# EAGLE design DDC118_eval2_rev1D (EAGLE 6.3)
Assembly variants: low-on-parts
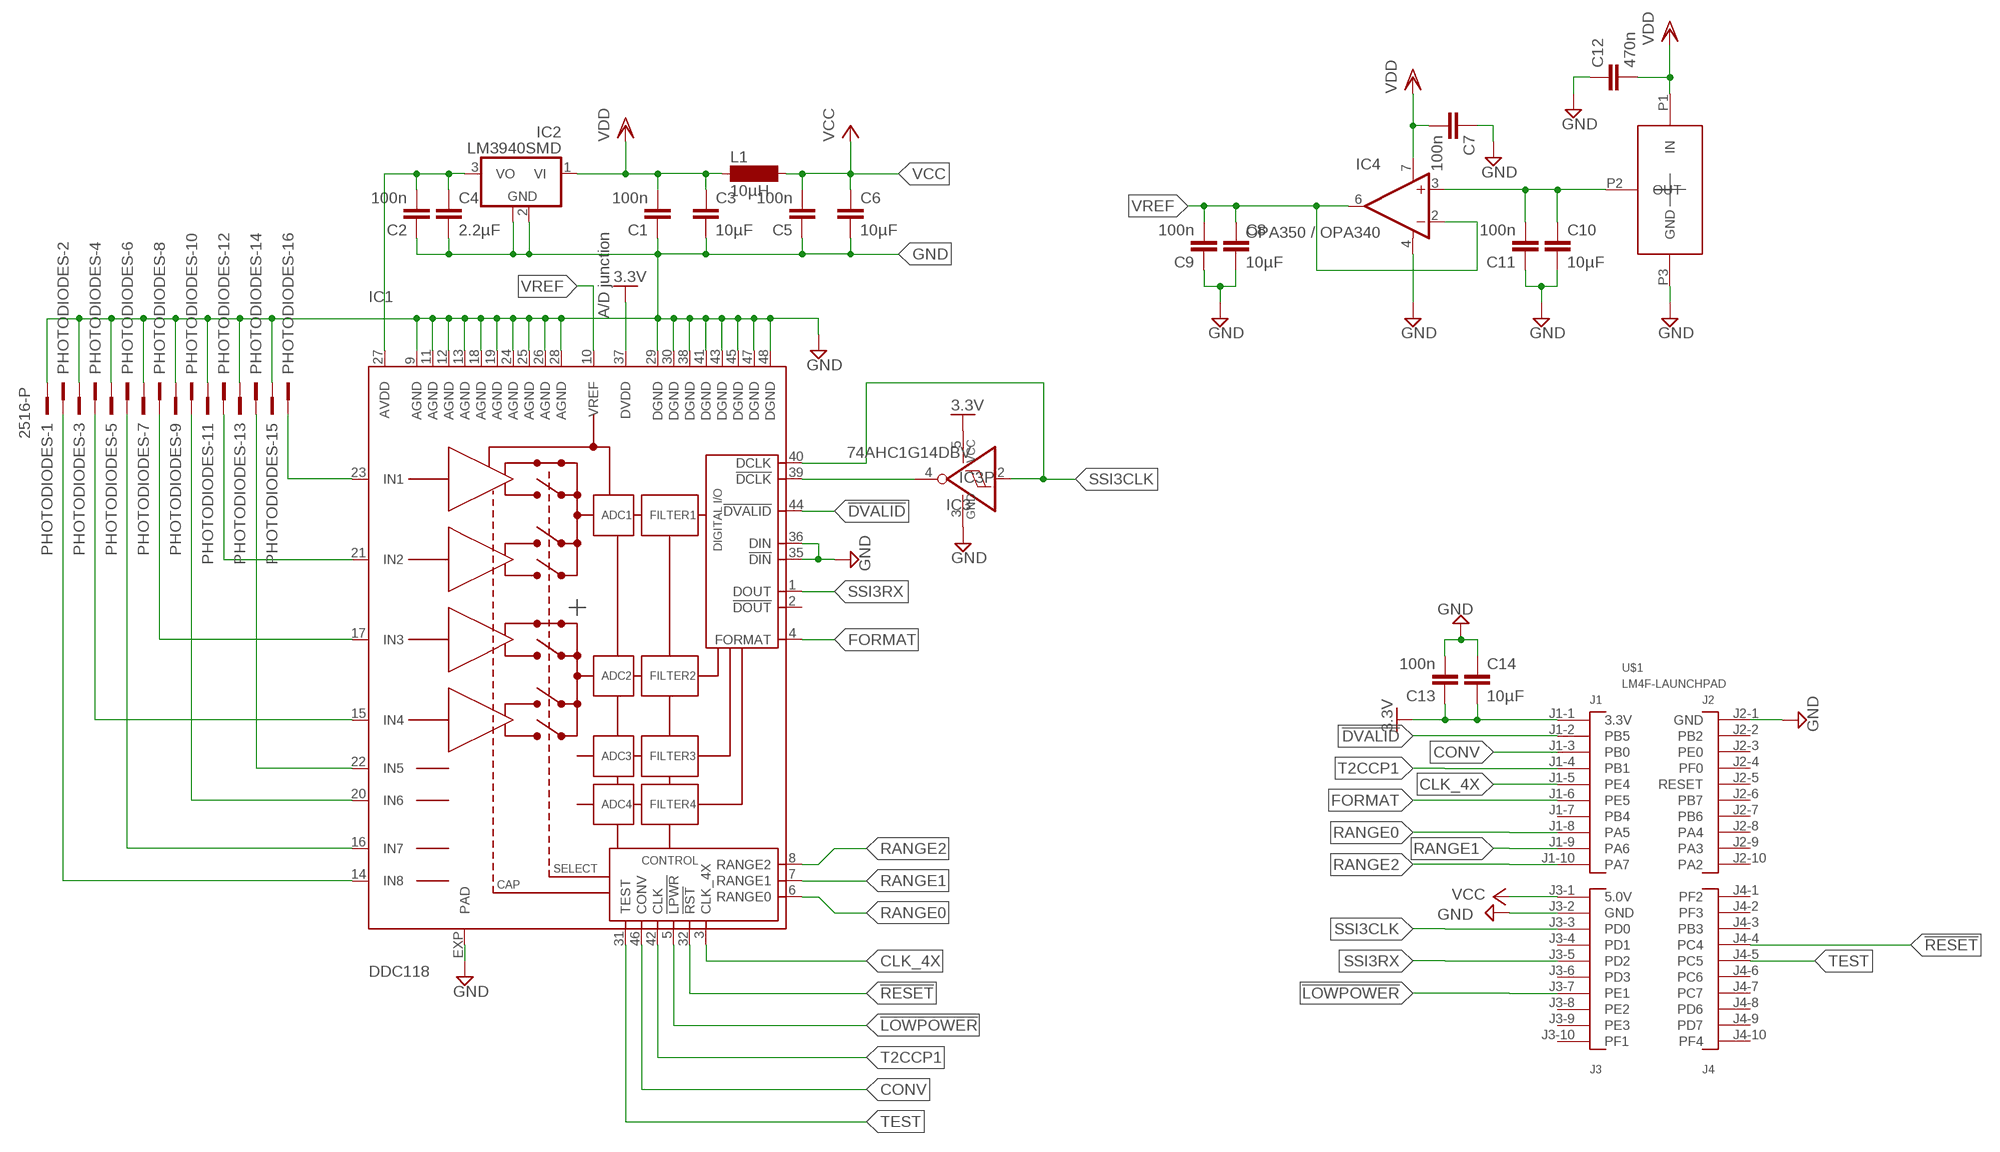
[diagram p0: schematic, sheet 1]

## Parts
C1  100n  C-EUC0805K  [C0805K]  (not fitted in variant low-on-parts)
C2  100n  C-EUC0805K  [C0805K]  (not fitted in variant low-on-parts)
C3  10µF  C-EUC0805  [C0805]
C4  2.2µF  C-EUC0805  [C0805]  (variant low-on-parts: 4µ7)
C5  100n  C-EUC0805K  [C0805K]
C6  10µF  C-EUC0805  [C0805]  (not fitted in variant low-on-parts)
C7  100n  C-EUC0805K  [C0805K]
C8  10µF  C-EUC0805  [C0805]  (variant low-on-parts: 4µ7)
C9  100n  C-EUC0805K  [C0805K]  (not fitted in variant low-on-parts)
C10  10µF  C-EUC0805  [C0805]  (not fitted in variant low-on-parts)
C11  100n  C-EUC0805K  [C0805K]
C12  470n  C-EUC0805K  [C0805K]
C13  100n  C-EUC0805K  [C0805K]  (variant low-on-parts: 470n)
C14  10µF  C-EUC0805  [C0805]  (variant low-on-parts: 4µ7)
IC1  DDC118  [RGZ_S-PVQFN-N48]
IC2  LM3940SMD  [SOT223]
IC3  74AHC1G14DBV  [SOT23-5]
IC4  OPA350 / OPA340  OPA340U  [SO08]
L1  10µH  MS50  [MS50]
PHOTODIODES  2516-P  [PAK100/2500-16-PADS]
U1  REF30XX  [SOT-23]
U$1  LM4F-LAUNCHPAD  [LM4F120-LAUNCHPAD]

## Nets
!DCLK: IC1.39(!DCLK) IC3.4(O)
!DVALID: IC1.44(!DVALID) U$1.J1-2(PB5)
!LOWPOWER: IC1.5(!LPWR) U$1.J3-7(PE1)
!RESET: IC1.32(!RST) U$1.J4-4(PC4)
+3.3V: C13.1 C14.2 IC1.37(DVDD) IC3.5(VCC) U$1.J1-1(3.3V) ; supply symbol labelled 3.3V
AVDD: C2.2 C4.1 IC1.27(AVDD) IC2.3(VO)
CLK_4X: IC1.3(CLK_4X) U$1.J1-5(PE4)
CONV: IC1.46(CONV) U$1.J1-3(PB0)
FORMAT: IC1.4(FORMAT) U$1.J1-6(PE5)
GND: C1.1 C2.1 C3.2 C4.2 C5.1 C6.2 C7.1 C8.2 C9.1 C10.2 C11.1 C12.1 C13.2 C14.1 IC1.9(AGND) IC1.11(AGND) IC1.12(AGND) IC1.13(AGND) IC1.18(AGND) IC1.19(AGND) IC1.24(AGND) IC1.25(AGND) IC1.26(AGND) IC1.28(AGND) IC1.29(DGND) IC1.30(DGND) IC1.35(!DIN) IC1.36(DIN) IC1.38(DGND) IC1.41(DGND) IC1.43(DGND) IC1.45(DGND) IC1.47(DGND) IC1.48(DGND) IC1.EXP(PAD) IC2.2(GND) IC2.4(GND) IC3.3(GND) IC4.4(V-) PHOTODIODES.1 PHOTODIODES.3 PHOTODIODES.5 PHOTODIODES.7 PHOTODIODES.9 PHOTODIODES.11 PHOTODIODES.13 PHOTODIODES.15 U1.P3(GND) U$1.J2-1(GND) U$1.J3-2(GND)
N$2: IC1.21(IN2) PHOTODIODES.12
N$3: IC1.23(IN1) PHOTODIODES.16
N$4: IC1.20(IN6) PHOTODIODES.10
N$5: IC1.17(IN3) PHOTODIODES.8
N$6: IC1.16(IN7) PHOTODIODES.6
N$7: IC1.22(IN5) PHOTODIODES.14
N$8: IC1.15(IN4) PHOTODIODES.4
N$9: IC1.14(IN8) PHOTODIODES.2
N$14: C10.1 C11.2 IC4.3(+IN) U1.P2(OUT)
RANGE0: IC1.6(RANGE0) U$1.J1-8(PA5)
RANGE1: IC1.7(RANGE1) U$1.J1-9(PA6)
RANGE2: IC1.8(RANGE2) U$1.J1-10(PA7)
SSI3CLK: IC1.40(DCLK) IC3.2(I) U$1.J3-3(PD0)
SSI3RX: IC1.1(DOUT) U$1.J3-5(PD2)
T2CCP1: IC1.42(CLK) U$1.J1-4(PB1)
TEST: IC1.31(TEST) U$1.J4-5(PC5)
VCC: C5.2 C6.1 L1.2 U$1.J3-1(5.0V)
VDD: C1.2 C3.1 C7.2 C12.2 IC2.1(VI) IC4.7(V+) L1.1 U1.P1(IN)
VREF: C8.1 C9.2 IC1.10(VREF) IC4.2(-IN) IC4.6(OUT)
Unconnected: IC1.2(!DOUT) U$1.J1-7(PB4) U$1.J2-2(PB2) U$1.J2-3(PE0) U$1.J2-4(PF0) U$1.J2-5(RESET) U$1.J2-6(PB7) U$1.J2-7(PB6) U$1.J2-8(PA4) U$1.J2-9(PA3) U$1.J2-10(PA2) U$1.J3-4(PD1) U$1.J3-6(PD3) U$1.J3-8(PE2) U$1.J3-9(PE3) U$1.J3-10(PF1) U$1.J4-2(PF3) U$1.J4-3(PB3) U$1.J4-6(PC6) U$1.J4-7(PC7) U$1.J4-8(PD6) U$1.J4-9(PD7) U$1.J4-10(PF4)

## Notes on the sheet
- A/D junction

## Power pins joined to a net without a drawn wire
PF2: U$1.J4-1(PF2)

## Library data of the parts
C1-C14 = rcl:C-EU: CAPACITOR, European symbol
IC1 = texas-DAS:DDC118: Octal Current Input, 20-Bit Analog-To-Digital Converter Description: The DDC118 is a 20-bit, octal channel, current-input analog-to-digital (A/D) converter. It combines both current-to-voltage and A/D conversion so that eight low-level current output devices, such as photodiodes, can be directly connected to its inputs and digitized. For each of the eight inputs, the DDC118 provides a dual-switched integrator front-end. This design allows for continuous current integration: while one integrator is being digitized by the onboard A/D converter, the other is integrating the input current. Adjustable full-scale ranges from 12pC to 350pC and adjustable integration times from 50µs to 1s allow currents from fAs to µAs to be measured with outstanding precision. Low-level linearity is ±0.5ppm of the full-scale range and noise is 5.2ppm of the full-scale range. Two modes of operation are provided. In Low-Power mode, total power dissipation is only 13.5mW per channel with a maximum data rate of 2.5kSPS. High-Speed mode supports data rates up to 3.125kSPS with a corresponding dissipation of 18mW per channel. Features: SINGLE-CHIP SOLUTION TO DIRECTLY MEASURE EIGHT LOW-LEVEL CURRENTS HIGH PRECISION, TRUE INTEGRATING FUNCTION INTEGRAL LINEARITY: ±0.01% of Reading ±0.5ppm of FSR VERY LOW NOISE: 5.2ppm of FSR LOW POWER: 13.5mW/channel ADJUSTABLE DATA RATE: Up to 3.125kSPS PROGRAMMABLE FULL SCALE DAISY-CHAINABLE SERIAL INTERFACE Datasheet: http://www.ti.com/lit/ds/symlink/ddc118.pdf Additional information: Basics of operation can be found in the DDC112 datasheet: http://www.ti.com/lit/ds/symlink/ddc112.pdf For practical daisychaining and layout considerations, consider the DDC112 evaluation board documentation: http://www.ti.com/lit/an/sbaa029/sbaa029.pdf
IC2 = custom-parts:LM3940SMD: LM3940 1A Low Dropout Regulator for 5V to 3.3V Conversion http://www.ti.com/lit/ds/symlink/lm3940.pdf The LM3940 is a 1A low dropout regulator designed to provide 3.3V from a 5V supply. The LM3940 is ideally suited for systems which contain both 5V and 3.3V logic, with prime power provided from a 5V bus. Because the LM3940 is a true low dropout regulator, it can hold its 3.3V output in regulation with input voltages as low as 4.5V. The T0-220 package of the LM3940 means that in most ap- plications the full 1A of load current can be delivered without using an additional heatsink. The surface mount TO-263 package uses minimum board space, and gives excellent power dissipation capability when soldered to a copper plane on the PC board.
IC3 = 74xx-little-de:74*1G14: Single Schmitt-Trigger Inverter Gate
IC4 = burr-brown:OPA340: Rail-to-Rail Operational Amplifiers Single-Supply, MicroAmplifier(TM) Series; MPN: OPA340UA; OC_FARNELL: 1106196; OC_NEWARK: 24M5449
L1 = inductor-neosid:MS50: INDUCTOR SMD power inductor; OC_FARNELL: unknown; OC_NEWARK: unknown
PHOTODIODES = custom-conn:2516-: 3M (TM) Pak 100 4-Wall Header 2x8 Pins Source: 3M
U1 = custom-parts:REF30XX: CMOS VOLTAGE REFERENCE: 50ppm/°C, 50µA in SOT23-3 Description: The REF30xx is a precision, low power, low voltage dropout voltage reference family available in a tiny SOT23-3. The REF30xx?s small size and low power consumption (50µA max) make it ideal for portable and battery-powered applications. The REF30xx does not require a load capacitor, but is stable with any capacitive load. Unloaded, the REF30xx can be operated with supplies within 1mV of output voltage. All models are specified for the wide temperature range, ?40°C to +125°C. Features: MicroSIZE PACKAGE: SOT23-3 LOW DROPOUT: 1mV HIGH OUTPUT CURRENT: 25mA LOW TEMPERATURE DRIFT: 50ppm/°C max HIGH ACCURACY: 0.2% LOW IQ: 50µA max Datasheet: http://www.ti.com/lit/ds/sbvs032f/sbvs032f.pdf
U$1 = texas-LM4F-Launchpad:LM4F-LAUNCHPAD: Stellaris® LM4F120 LaunchPad - BoosterPack Footprint Description: The Stellaris® LM4F120 LaunchPad Evaluation Board (EK-LM4F120XL) is a low-cost evaluation platform for ARM® Cortex?-M4F-based microcontrollers. This is the 4x 10 pin main header to which add-on PCBs or mainbaords can connect. Additional Information: http://www.ti.com/lit/ug/spmu289a/spmu289a.pdf

## Net classes
0 default: width 0.15 mm, drill 0.3 mm, clearance 0.15 mm

## Board
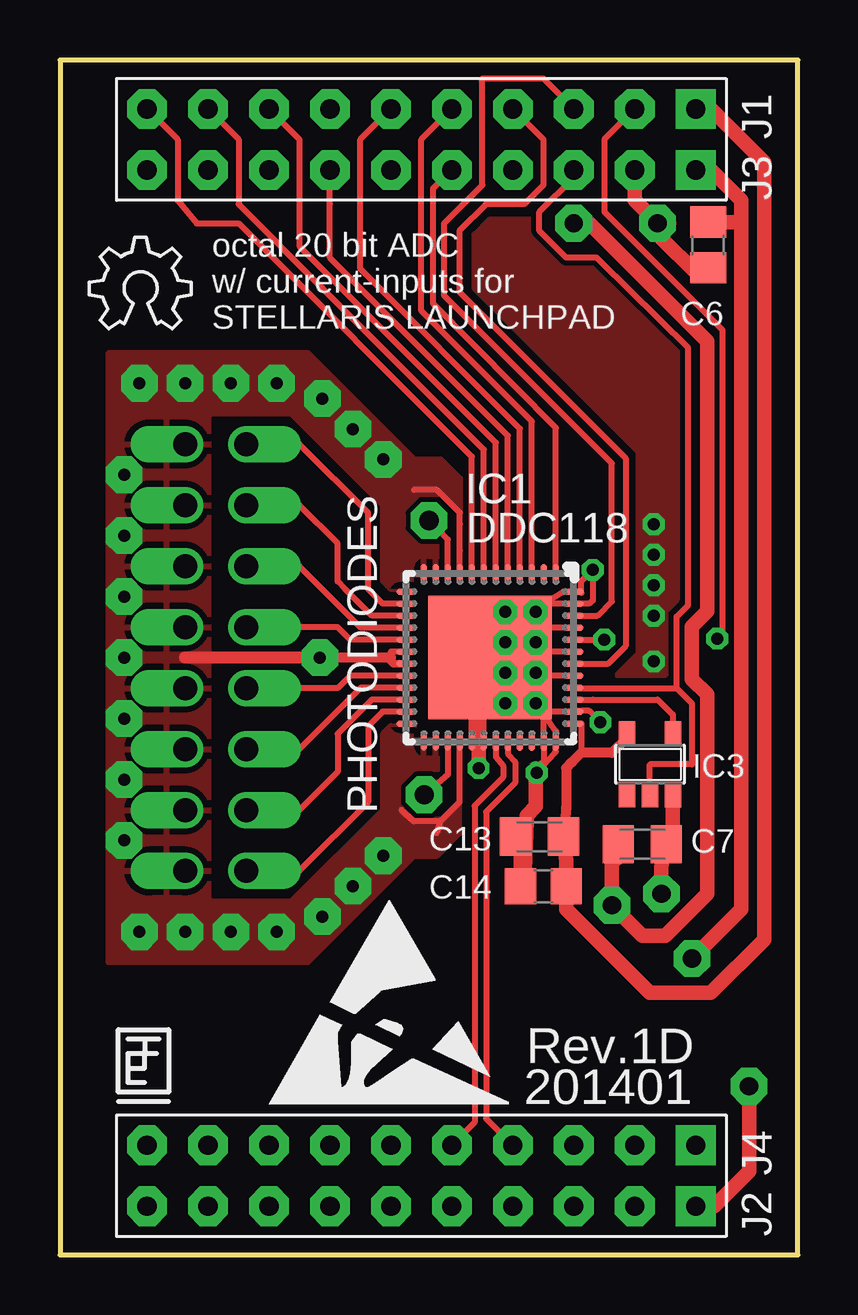
[diagram p1: board, top side]
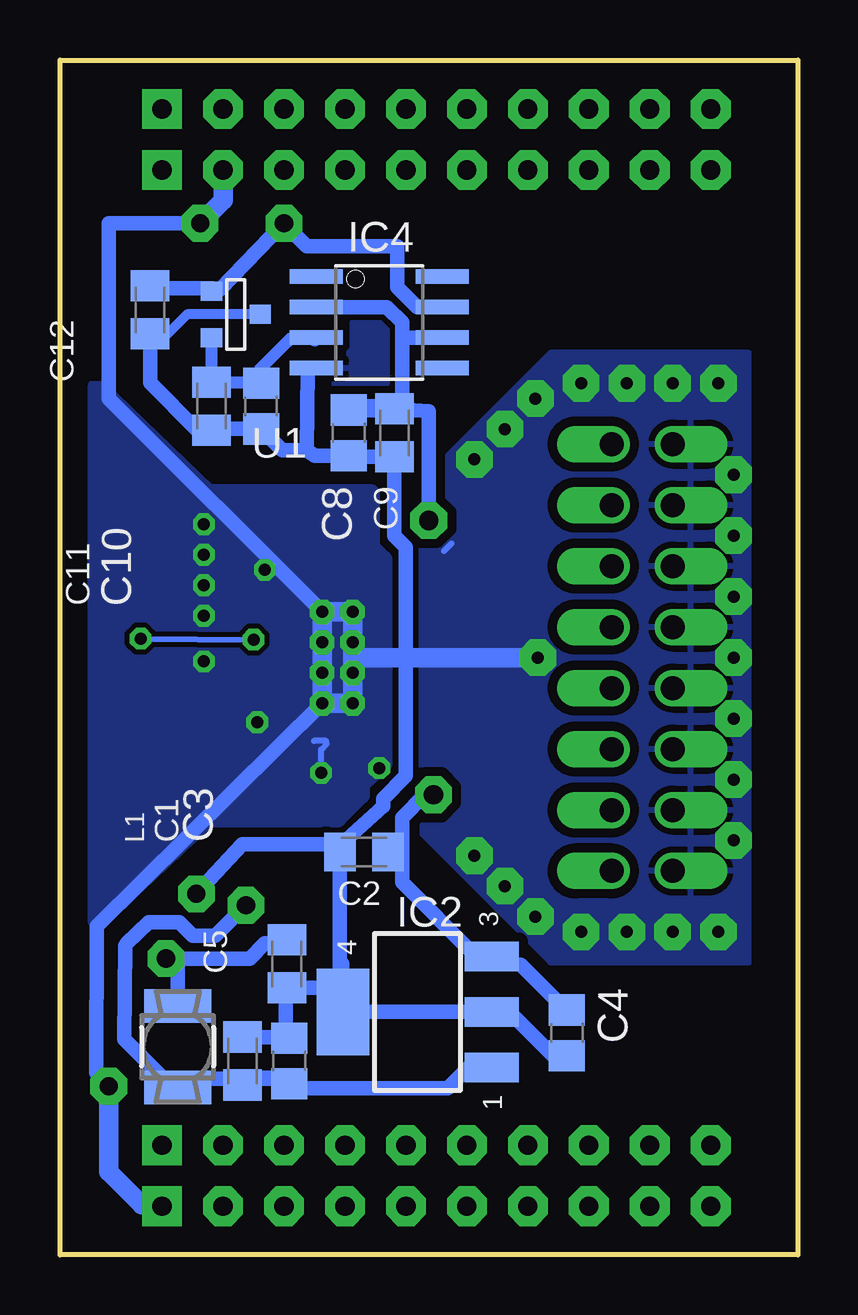
[diagram p2: board, bottom side, seen from below]

Size 30.74 x 49.79 mm. Coordinates in mm from the lower left corner, seen from the top.
Outline: 0,49.79 0,0 30.74,0 30.74,49.79 0,49.79
Copper layers (1*16): Top 0.035mm / dielectric 1.5mm / Bottom 0.035mm
Design rules "default *": minimum track width 10mil, minimum drill 0.4mm, track to track 8mil, track to pad 8mil, pad to pad 8mil, via to via 8mil, smd to smd 8mil, copper to edge 40mil, drill to drill 8mil, minimum pad ring 10mil, minimum via ring 8mil, stop-mask expansion 0.015mm, vias tented up to drill 0.3mm, thermal gap 10mil

### Footprints (pad centres in the part's own frame; a part is rotated, then mirrored left to right if it is on the bottom)
C0805K = smd 1.3 x 1.6: 1 -1,0; 2 1,0
C0805 = smd 1.3 x 1.5: 1 -0.95,0; 2 0.95,0
RGZ_S-PVQFN-N48 = smd 0.85 x 0.28: 1 -3.475,2.75; 2 -3.475,2.25; 3 -3.475,1.75; 4 -3.475,1.25; 5 -3.475,0.75; 6 -3.475,0.25; 7 -3.475,-0.25; 8 -3.475,-0.75; 9 -3.475,-1.25; 10 -3.475,-1.75; 11 -3.475,-2.25; 12 -3.475,-2.75; 25 3.45,-2.75; 26 3.45,-2.25; 27 3.45,-1.75; 28 3.45,-1.25; 29 3.45,-0.75; 30 3.45,-0.25; 31 3.475,0.25; 32 3.475,0.75; 33 3.475,1.25; 34 3.475,1.75; 35 3.475,2.25; 36 3.475,2.75 | smd 0.28 x 0.85: 13 -2.75,-3.475; 14 -2.25,-3.475; 15 -1.75,-3.475; 16 -1.25,-3.475; 17 -0.75,-3.475; 18 -0.25,-3.475; 19 0.25,-3.475; 20 0.75,-3.475; 21 1.25,-3.475; 22 1.75,-3.475; 23 2.25,-3.475; 24 2.75,-3.475; 37 2.75,3.475; 38 2.25,3.475; 39 1.75,3.475; 40 1.25,3.475; 41 0.75,3.475; 42 0.25,3.475; 43 -0.25,3.475; 44 -0.75,3.475; 45 -1.25,3.475; 46 -1.75,3.475; 47 -2.25,3.475; 48 -2.75,3.475 | smd 5.15 x 5.15: EXP 0,0
SOT223 = smd 1.219 x 2.235: 1 -2.311,-3.099; 2 0,-3.099; 3 2.311,-3.099 | smd 3.6 x 2.2: 4 0,3.099
SOT23-5 = smd 0.69 x 0.99: 1 -0.95,-1.29; 2 0,-1.29; 3 0.95,-1.29; 4 0.95,1.3; 5 -0.95,1.3
SO08 = smd 0.61 x 2.21: 1 -1.905,-2.616; 2 -0.635,-2.616; 3 0.635,-2.616; 4 1.905,-2.616; 5 1.905,2.616; 6 0.635,2.616; 7 -0.635,2.616; 8 -1.905,2.616
MS50 = smd 2.8 x 1.4: 1 0,-1.7; 2 0,1.7
PAK100/2500-16-PADS = drill 1 pad 1.524 offset: 1 -8.89,-1.27; 2 -8.89,1.27; 3 -6.35,-1.27; 4 -6.35,1.27; 5 -3.81,-1.27; 6 -3.81,1.27; 7 -1.27,-1.27; 8 -1.27,1.27; 9 1.27,-1.27; 10 1.27,1.27; 11 3.81,-1.27; 12 3.81,1.27; 13 6.35,-1.27; 14 6.35,1.27; 15 8.89,-1.27; 16 8.89,1.27
SOT-23 = smd 0.787 x 0.889: P1 -0.991,-1.016; P2 0.94,-1.016; P3 -0.025,1.016
LM4F120-LAUNCHPAD = drill 0.8 pad 1.651 square: J1-1 2.54,35.56; J2-1 48.26,35.56; J3-1 5.08,35.56; J4-1 45.72,35.56 | drill 0.8 pad 1.651 octagon: J1-2 2.54,33.02; J1-3 2.54,30.48; J1-4 2.54,27.94; J1-5 2.54,25.4; J1-6 2.54,22.86; J1-7 2.54,20.32; J1-8 2.54,17.78; J1-9 2.54,15.24; J1-10 2.54,12.7; J2-2 48.26,33.02; J2-3 48.26,30.48; J2-4 48.26,27.94; J2-5 48.26,25.4; J2-6 48.26,22.86; J2-7 48.26,20.32; J2-8 48.26,17.78; J2-9 48.26,15.24; J2-10 48.26,12.7; J3-2 5.08,33.02; J3-3 5.08,30.48; J3-4 5.08,27.94; J3-5 5.08,25.4; J3-6 5.08,22.86; J3-7 5.08,20.32; J3-8 5.08,17.78; J3-9 5.08,15.24; J3-10 5.08,12.7; J4-2 45.72,33.02; J4-3 45.72,30.48; J4-4 45.72,27.94; J4-5 45.72,25.4; J4-6 45.72,22.86; J4-7 45.72,20.32; J4-8 45.72,17.78; J4-9 45.72,15.24; J4-10 45.72,12.7

### Placement (x,y rotation side)
C1  23.14,8.08 270 bottom
C2  18.07,16.79 0 bottom
C3  21.19,8.08 90 bottom
C4  9.62,9.25 270 bottom
C5  21.29,12.13 90 bottom
C6  27,42.08 270 top
C7  24.26,17.11 180 top
C8  18.71,34.25 270 bottom
C9  16.8,34.25 90 bottom
C10  22.36,35.36 270 bottom
C11  24.42,35.36 90 bottom
C12  26.99,39.38 90 bottom
C13  19.98,17.43 180 top
C14  20.14,15.36 0 top
IC1  17.91,24.89 270 top
IC2  15.85,10.12 90 bottom
IC3  24.58,20.44 0 top
IC4  17.44,38.86 270 bottom
L1  25.83,8.67 0 bottom
PHOTODIODES  6.49,24.89 270 top
U1  23.41,39.16 270 bottom
U$1  -9.07,50.29 270 top
U$2  [OSHW_6X150_NOTEXT]  1.23,38.59 0 top
U$3  [ESD_10.00]  8.63,6.19 0 top

### Tracks (layer width: path | path; a pad name or v marks a point on that pad's centre or on a via)
!DCLK
  Top 0.254: IC1.39 22.2,23.14 24.9,23.14 25.54,22.51 IC3.4
!DVALID  (via drill 0.5 pad 0.76)
  Top 0.254: IC1.44 v22.68,25.64 | U$1.J1-2 22.68,46.48 22.68,43.46 27.6,38.54 27.6,26 v27.38,25.68
  Bottom 0.254: v27.38,25.68 v22.68,25.64
!LOWPOWER
  Top 0.254: IC1.5 18.67,34.14 11.25,41.56 11.25,43.78 11.25,43.94 U$1.J3-7
!RESET
  Top 0.254: IC1.32 18.67,20.89 18.97,20.55 18.97,19.66 17.76,18.46 17.76,5.68 U$1.J4-4
+3.3V
  Top 0.254: IC1.37 21.72,22.14 21.72,21.71 21.72,20.92 21.33,20.52
  Top 0.406: C13.1 21.09,18.65 21.09,20.28 21.33,20.52 21.72,20.92 22.99,20.92 23.63,21.56 IC3.5
  Top 0.61: U$1.J1-1 27.12,47.75 29.35,45.53 29.35,13.14 27.12,10.92 24.58,10.92 21.09,14.41 21.09,16.31 C14.2 21.09,16.42 C13.1
AVDD  (via drill 0.8 pad 1.52)
  Top 0.254: IC1.27 16.17,20.01 v15.18,19.17
  Bottom 0.61: v15.18,19.17 15.53,19.17 16.49,18.22 16.49,16.9 | 16.49,16.9 C2.2 | C4.1 9.32,9.86 11.54,12.09 12.5,12.19 IC2.3 12.82,12.51 13.47,12.51 16.49,15.52 16.49,16.9
CLK_4X
  Top 0.254: IC1.3 19.67,34.73 15.06,39.33 15.06,46.48 U$1.J1-5
CONV
  Top 0.254: IC1.46 22.4,26.64 22.99,27.23 22.99,32.98 16.01,39.97 16.01,42.99 17.6,44.57 17.6,49.02 20.14,49.02 U$1.J1-3
FORMAT
  Top 0.254: IC1.4 19.17,34.43 12.52,41.08 12.52,46.48 U$1.J1-6
GND  (via drill 0.5 pad 0.76, 0.5 pad 1.02, 0.5 pad 1.52, 0.76 pad 1.52)
  Top 0.254: IC1.18 13.79,25.14 13.79,24.89 | IC1.47 20.17,27.14 20.14,27.11 | IC1.48 20.98,27.64 20.14,27.11 | 20.14,27.11 v19.82,26.79 | v19.82,26.79 19.5,26.48 | 19.5,26.48 v18.55,25.52 IC1.EXP | IC1.45 19.84,26.14 | 19.84,26.14 19.5,26.48 | IC1.43 20.2,25.14 | 20.2,25.14 v19.82,25.52 19.82,26.12 19.84,26.14 | IC1.41 20.25,24.14 | 20.25,24.14 20.14,24.25 | 20.14,24.25 20.14,25.07 20.2,25.14 | 20.17,22.64 IC1.38 21.54,22.64 21.57,22.66 | 20.17,22.64 19.98,22.82 | 19.98,22.82 v19.82,22.98 19.82,23.71 20.25,24.14 | 20.17,22.64 IC1.35 20.17,20.57 19.82,20.28 20.14,20.41 20.61,20.92 20.67,20.97 IC1.36 20.67,21.82 19.98,22.82 | IC1.30 17.67,23.05 | 17.6,23.3 17.67,23.23 17.67,23.05 | 17.6,23.3 17.6,24.57 IC1.EXP | IC1.29 17.17,22.87 17.28,22.98 | 17.28,22.98 17.6,23.3 | 16.67,23 16.96,23.3 17.6,23.3 | 17.67,23.05 17.6,22.98 | 17.6,22.98 17.28,22.98 | 17.28,22.98 17.28,24.25 v18.55,24.25 | IC1.EXP 17.28,25.52 | v18.55,26.79 v19.82,26.79 | v18.55,22.98 17.6,22.98 | v19.82,24.25 20.14,24.25 | 25.53,17.22 C7.1 25.11,16.52 | IC1.9 16.67,29.35 16.67,30.44 16.67,30.92 15.69,31.87 14.74,31.87 | 15.85,18.06 14.74,18.06 14.22,18.54 | 15.85,18.06 15.69,17.59 | IC1.28 16.65,21.42 16.65,18.85 15.85,18.06 | 21.57,27.14 22.04,27.14 22.2,27.27 v22.2,28.54 21.72,28.06 21.72,27.59 | PHOTODIODES.3 5.21,30.6 | 5.21,26.48 PHOTODIODES.7 | v22.52,22.19 22.04,22.66 21.72,22.66 21.57,22.66 | 21.57,22.66 21.41,22.66 21.57,22.66
  Top 0.305: IC1.19 13.88,24.64 13.63,24.89
  Top 0.406: 13.79,24.89 13.63,24.89 v10.83,24.89
  Top 0.5: v10.83,24.89 5.21,24.89
  Top 0.61: 25.53,17.22 IC3.3 25.53,19.01 | C6.2 26.41,41.03 25.13,42.29 25.06,42.35 25.06,42.82 25.38,42.98 v24.9,42.99 23.95,43.94 U$1.J3-2 | U$1.J2-1 27.27,2.03 28.71,3.49 28.71,3.79 v28.71,7.03 | 25.11,16.52 25.06,16.16 v25.06,15.04 | C13.2 19.19,17.06 C14.1 19.19,15.52 19.35,15.52 19.45,18.09 19.45,18.31 19.83,18.69 19.82,20.28 | v17.44,20.28 17.44,22.66
  Bottom 0.254: 14.74,29.33 14.42,29.65 | v19.86,20.08 19.86,21.05 19.63,21.29 19.66,21.41 IC1.35
  Bottom 0.406: U1.P3 25.44,39.19 26.47,38.16
  Bottom 0.508: IC4.4 20.36,36.95 20.43,36.89
  Bottom 0.61: v24.9,42.99 28.71,42.99 28.71,35.68 v19.82,26.79 | v28.71,7.03 29.23,7.59 29.21,13.69 v19.82,22.98 | 19.03,17.11 23.15,17.11 v25.06,15.04 | 19.03,17.11 17.28,18.7 17.28,19.01 16.33,19.97 16.33,24.89 16.33,29.49 16.8,29.97 16.8,32.67 16.65,32.98 16.65,33.1 C9.1 18.66,33.25 C8.2 20.12,33.3 20.45,33.54 | 19.07,11.71 C2.1 18.71,17.16 19.03,17.11 | 19.07,11.71 19.07,11.08 | 19.07,11.08 19.07,10.25 IC2.4 IC2.2 11.92,10.02 9.85,7.96 9.97,8.06 C4.2 | 18.98,12.14 18.98,11.81 19.07,11.71 | C1.1 21.14,9.08 C3.2 21.33,9.19 21.33,10.89 C5.1 19.12,11.13 19.07,11.08 | 20.43,36.89 20.45,33.54 | 20.45,33.54 21.48,33.54 C10.2 24.37,34.42 C11.1 24.47,34.41 25.06,34.41 26.99,36.34 C12.1 26.47,38.16
  Bottom 0.813: v10.83,24.89 16.33,24.89 18.55,24.89 | 18.55,24.89 v18.55,24.25 v18.55,22.98 v19.82,22.98 v19.82,24.25 v19.82,25.52 v19.82,26.79 v18.55,26.79 v18.55,25.52 18.55,24.89 | v24.9,42.99 23.95,43.94 U$1.J3-2 | U$1.J2-1 27.33,2.09 28.71,3.47 v28.71,7.03
  other vias: 13.47,16.63 12.2,15.36 10.93,14.09 9.03,13.46 7.12,13.46 5.21,13.46 3.31,13.46 2.68,17.27 2.68,19.81 2.68,22.35 2.68,24.89 2.68,27.43 2.68,29.97 2.68,32.51 13.47,33.14 12.2,34.41 10.93,35.68 9.03,36.32 7.12,36.32 5.21,36.32 3.31,36.32 24.74,30.44 24.74,29.17 24.74,27.9 24.74,26.63 24.74,24.73
  pour Top: 15.69,32.19 15.69,28.06 14.74,28.06 14.74,27.75 13.79,27.75 13.47,28.06 13.47,31.24 9.66,35.05 6.17,35.05 6.17,14.73 9.66,14.73 13.47,18.54 13.47,21.71 13.79,22.03 14.74,22.03 14.74,21.71 15.69,21.71 15.69,17.59 10.29,12.19 2.04,12.19 2.04,37.59 10.29,37.59
  pour Bottom (isolate 0.381): 15.69,32.19 15.69,17.59 10.29,12.19 2.04,12.19 2.04,37.59 10.29,37.59
  pour Bottom: 24.58,31.71 17.81,31.71 17.81,29.49 17.3,28.97 17.3,20.48 18.23,19.65 18.23,19.17 19.18,18.22 24.58,18.22 29.19,13.93 29.19,36.16
  pour Top: 15.69,31.87 15.69,32.19 14.74,33.14 15.85,33.14 16.66,32.35 16.66,30.92
  pour Top: 16.64,18.86 15.85,18.06 14.74,18.06 14.74,16.63 15.69,16.63 16.64,17.59
  pour Bottom: 19.66,36.63 19.66,37.27 19.5,37.43 18.87,37.43 18.55,37.75 18.55,38.86 17.44,38.86 17.12,38.54 17.12,36.32 19.34,36.32
  pour Top (isolate 0.203): 25.69,37.69 25.69,27.29 25.22,26.81 25.22,24.15 23.21,24.15 24.11,25.05 24.11,33.46 17.28,40.29 17.28,42.51 17.91,43.14 20.14,43.14
N$2
  Top 0.254: IC1.21 12.54,23.64 9.98,21.08 PHOTODIODES.12
N$3
  Top 0.254: IC1.23 13.44,22.64 12.84,22.03 12.84,18.85 9.98,16 PHOTODIODES.16
N$4
  Top 0.254: IC1.20 12.09,24.14 11.56,23.62 PHOTODIODES.10
N$5
  Top 0.254: IC1.17 12.09,25.64 11.56,26.16 PHOTODIODES.8
N$6
  Top 0.254: IC1.16 12.54,26.14 9.98,28.7 PHOTODIODES.6
N$7
  Top 0.254: IC1.22 12.99,23.14 11.56,21.71 11.56,20.12 9.98,18.54 PHOTODIODES.14
N$8
  Top 0.254: IC1.15 12.99,26.64 11.88,27.75 11.56,28.06 11.56,29.65 9.98,31.24 8.71,31.24 PHOTODIODES.4
N$9
  Top 0.254: IC1.14 13.44,27.14 13.15,27.43 12.84,27.75 12.84,30.92 9.98,33.78 PHOTODIODES.2
N$14
  Bottom 0.508: U1.P2 C11.2 22.41,36.36 | 22.41,36.36 C10.1 | 22.41,36.36 22.41,36.9 21.23,38.09 21.13,38.19 20.09,38.19 IC4.3
  Bottom 0.61: 22.41,36.36 C10.1 | 20.12,38.16 IC4.3
RANGE0
  Top 0.254: IC1.6 18.17,33.85 9.98,42.03 9.98,43.78 9.98,43.94 9.98,46.48 U$1.J1-8
RANGE1
  Top 0.254: IC1.7 17.67,33.55 10.93,40.29 | 10.93,40.29 10.77,40.45 10.93,40.29 | U$1.J1-9 7.44,46.48 7.44,43.78 10.93,40.29
RANGE2
  Top 0.254: IC1.8 17.17,33.26 7.44,42.99 5.69,42.99 4.9,43.94 4.9,46.48 U$1.J1-10
SSI3CLK
  Top 0.254: IC1.40 21.41,23.62 25.69,23.62 | 25.69,23.62 25.69,26.6 26.17,27.07 26.17,37.81 22.52,41.4 22.36,41.56 21.09,41.56 19.98,42.67 19.98,43.46 21.41,44.89 U$1.J3-3 | IC3.2 24.58,20.44 26.33,20.44 26.33,22.98 25.69,23.62
SSI3RX
  Top 0.254: U$1.J3-5 15.53,44.41 15.53,39.65 20.67,34.46 IC1.1
T2CCP1
  Top 0.254: U$1.J1-4 20.14,46.48 20.14,44.57 19.34,43.78 17.76,43.78 16.65,42.67 16.65,40.13 23.57,33.2 23.57,25.36 22.85,24.64 IC1.42
TEST
  Top 0.254: IC1.31 18.17,20.75 18.47,20.39 18.47,19.9 17.28,18.71 17.28,5.52 U$1.J4-5
VCC  (via drill 0.76 pad 1.52)
  Top 0.61: U$1.J3-1 27.12,45.21 28.39,43.94 | 28.39,43.94 28.39,43.04 | 28.39,43.04 C6.1 | 28.39,43.94 28.39,43.04 | 28.39,43.04 28.39,14.41 v26.33,12.35
  Bottom 0.61: v26.33,12.35 25.69,12.35 | 25.69,12.35 22.84,12.35 22.2,12.98 21.14,12.98 C5.2 | L1.2 25.83,12.29 25.69,12.35
VDD  (via drill 0.76 pad 1.52)
  Top 0.254: 23.11,17.16 C7.2 23.31,16.95 23.31,16.79
  Top 0.61: 23.31,16.79 23.31,16.63 22.99,16.32 v22.99,14.57 24.26,13.3 25.22,13.3 26.96,15.04 26.96,23.36 26.33,23.99 26.33,26.18 26.96,26.81 26.96,38.06 22.04,42.99 v21.41,42.99
  Bottom 0.61: IC2.1 13.72,7.81 14.58,6.95 20.61,6.95 C3.1 21.14,7.38 22.36,7.38 | 22.36,7.38 C1.2 | 22.31,7.33 25.87,7.33 L1.1 26.53,7.47 28.06,9 28.03,12.89 27.96,12.98 27.04,13.85 25.77,13.85 25.22,13.3 24.26,13.3 v22.99,14.57 | 21.77,7.33 22.31,7.33 | 22.31,7.33 22.36,7.38 | IC4.7 15.85,39.49 16.69,40.33 16.69,42.03 20.45,42.03 v21.41,42.99 24.08,40.21 U1.P1 24.37,40.29 26.49,40.29 C12.2
VREF  (via drill 0.8 pad 1.52)
  Top 0.254: IC1.10 16.17,29.8 v15.37,30.6
  Bottom 0.61: v15.37,30.6 15.37,35.16 C9.2 | C8.1 16.85,35.2 C9.2 | C9.2 17.96,35.25 18.07,35.36 16.49,35.36 16.49,38.14 | 16.49,38.14 16.17,38.22 IC4.6 | IC4.2 17.12,39.49 16.49,38.86 16.49,38.68 16.49,38.14

### Text on the board
tPlace: octal 20 bit ADC / w/ current-inputs for / STELLARIS LAUNCHPAD | DDC118 | Rev.1D | 201401